# Altium schematic sheet CoreBoard.SchDoc
size A4
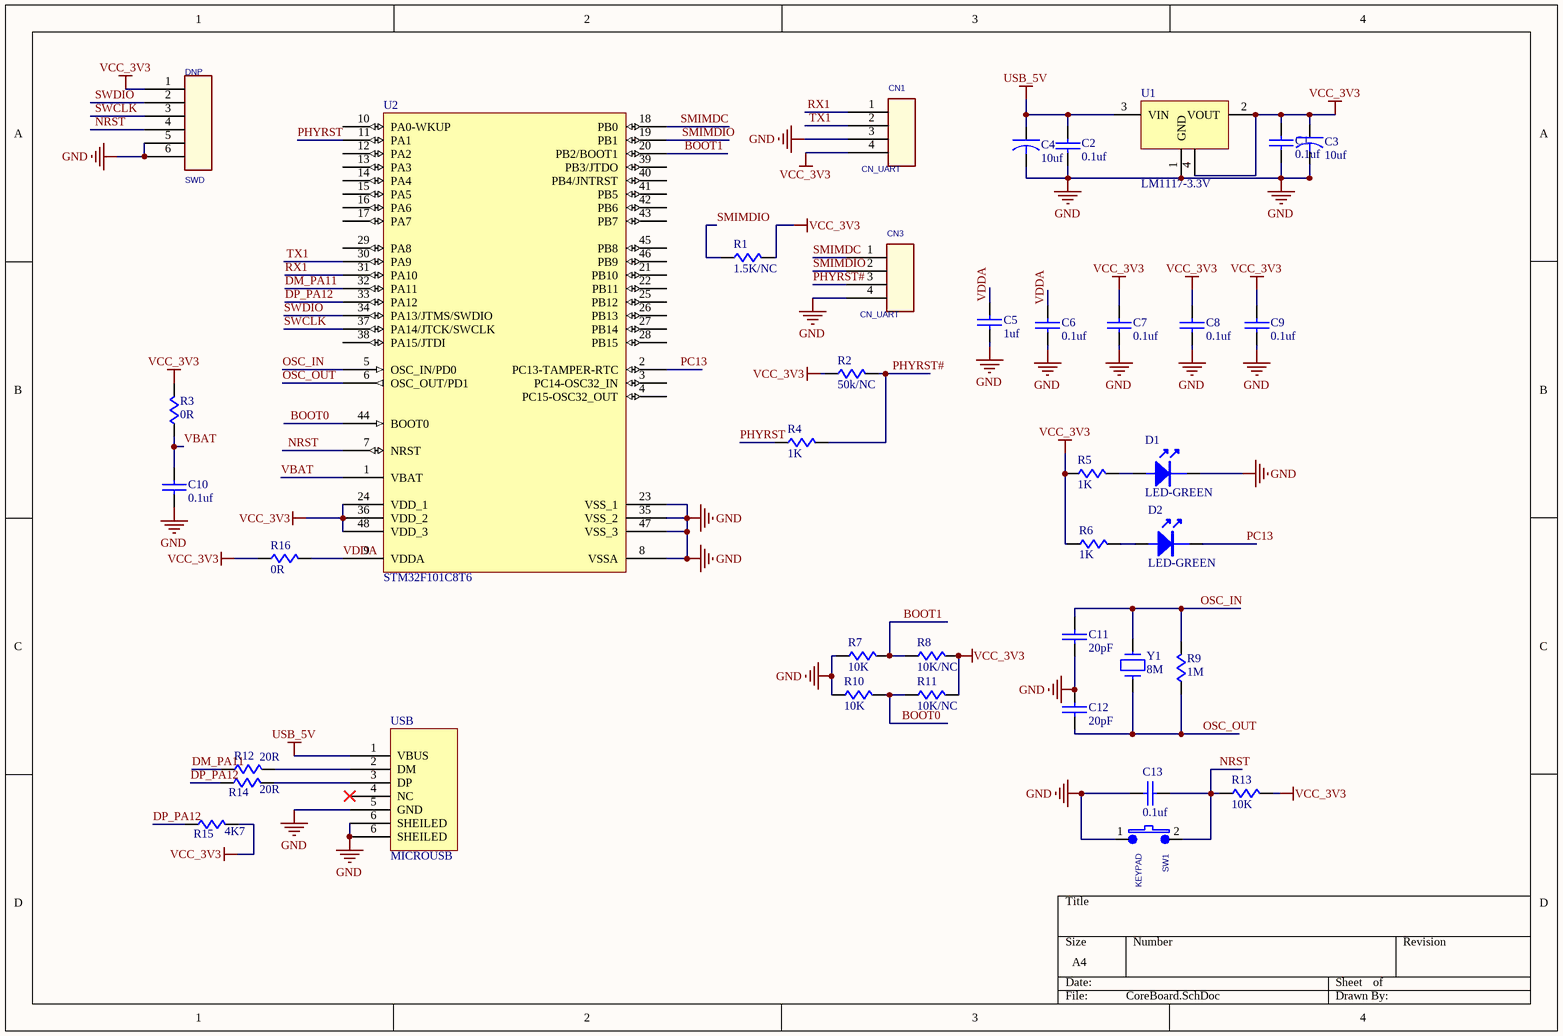
[diagram p0: CoreBoard.SchDoc]

## Parts
C1  0.1uf  [C0603]
C2  0.1uf  [C0603]
C3  10uf  [SMD-CT-2012]
C4  10uf  [SMD-CT-2012]
C5  1uf  [C0603]
C6  0.1uf  [C0603]
C7  0.1uf  [C0603]
C8  0.1uf  [C0603]
C9  0.1uf  [C0603]
C10  0.1uf  [C0603]
C11  20pF  [C0603]
C12  20pF  [C0603]
C13  0.1uf  [C0603]
CN1  CN_UART  [CON_SIP4BOX_2MM]
CN3  CN_UART  [CON_SIP4BOX_2MM]
D1  LED-GREEN  [LED-0805]
D2  LED-GREEN  [LED-0805]
R1  1.5K/NC  [R0603]
R2  50k/NC  [R0603]
R3  0R  [R0603]
R4  1K  [R0603]
R5  1K  [R0603]
R6  1K  [R0603]
R7  10K  [R0603]
R8  10K/NC  [R0603]
R9  1M  [R0603]
R10  10K  [R0603]
R11  10K/NC  [R0603]
R12  20R  [R0603]
R13  10K  [R0603]
R14  20R  [R0603]
R15  4K7  [R0603]
R16  0R  [R0603]
SW1  KEYPAD  [SWITCH_T06B]
SWD  DNP  [CON_SIP6BOX_2MM]
U1  LM1117-3.3V  [SOT-223]
U2  STM32F101C8T6  [LQFP48_N]
USB  MICROUSB  [MICRO-USB]
Y1  8M  [5032-2P]

## Nets
GND: C1.2 C2.2 C3.2 C4.2 C5.2 C6.2 C7.2 C8.2 C9.2 C10.2 C11.2 C12.1 C13.1 CN1.3 CN3.4 D1.1 R7.1 R10.1 SW1.1 SWD.5 SWD.6 U1.1(GND) U2.8(VSSA) U2.23(VSS_1) U2.35(VSS_2) U2.47(VSS_3) USB.5(GND) USB.6(SHEILED)
USB_5V: C2.1 C4.1 U1.3(VIN) USB.1(VBUS)
VCC_3V3: C1.1 C3.1 C7.1 C8.1 C9.1 CN1.4 R1.2 R2.1 R3.2 R5.1 R6.1 R8.2 R11.2 R13.2 R15.2 R16.1 SWD.1 U1.2(VOUT) U1.4 U2.24(VDD_1) U2.36(VDD_2) U2.48(VDD_3)
BOOT0: R10.2 R11.1 U2.44(BOOT0)
BOOT1: R7.2 R8.1 U2.20(PB2/BOOT1)
DM_PA11: R12.1 U2.32(PA11)
DP_PA12: R14.1 R15.1 U2.33(PA12)
NRST: C13.2 R13.1 SW1.2 SWD.4 U2.7(NRST)
OSC_IN: C11.1 R9.2 U2.5(OSC_IN/PD0) Y1.2
OSC_OUT: C12.2 R9.1 U2.6(OSC_OUT/PD1) Y1.1
PC13: D2.1 U2.2(PC13-TAMPER-RTC)
PHYRST: R4.1 U2.11(PA1)
PHYRST#: CN3.3 R2.2 R4.2
RX1: CN1.1 U2.31(PA10)
SMIMDC: CN3.1 U2.18(PB0)
SMIMDIO: CN3.2 R1.1 U2.19(PB1)
SWCLK: SWD.3 U2.37(PA14/JTCK/SWCLK)
SWDIO: SWD.2 U2.34(PA13/JTMS/SWDIO)
TX1: CN1.2 U2.30(PA9)
VBAT: C10.1 R3.1 U2.1(VBAT)
VDDA: C5.1 C6.1 R16.2 U2.9(VDDA)
NetD1_2: D1.2 R5.2
NetD2_2: D2.2 R6.2
NetR12_2: R12.2 USB.2(DM)
NetR14_2: R14.2 USB.3(DP)

Not connected (* = marked no-connect by the designer): U2 3(PC14-OSC32_IN) 4(PC15-OSC32_OUT) 10(PA0-WKUP) 12(PA2) 13(PA3) 14(PA4) 15(PA5) 16(PA6) 17(PA7) 21(PB10) 22(PB11) 25(PB12) 26(PB13) 27(PB14) 28(PB15) 29(PA8) 38(PA15/JTDI) 39(PB3/JTDO) 40(PB4/JNTRST) 41(PB5) 42(PB6) 43(PB7) 45(PB8) 46(PB9); USB 4(NC)*

## Library data of the parts
C1 C2 C5-C10 C13 = CAP_1: Capacitor
C3 C4 = CAPACITOR
C11 C12 = CAP: Capacitor
CN1 CN3 = CON4
D1 D2 = LED
R1-R16 = RES1
SW1 = PUSHBUTTON_TSKB-2L_0
SWD = CON6
U1 = LM1117
U2 = STM32F101C8T6: STM32 ARM-based 32-bit MCU with 64 Kbytes Flash, 48-pin LQFP, Industrial Temperature; Published: *; DatasheetVersion: *; PackageVersion: *; PackageReference: *; Publisher: *; PackageDescription: *; ComponentLink1Description: *; ComponentLink1URL: *; ComponentLink2Description: *; ComponentLink2URL: *
Y1 = CRYSTAL